# EAGLE schematic LM317 (EAGLE 7.6.0)
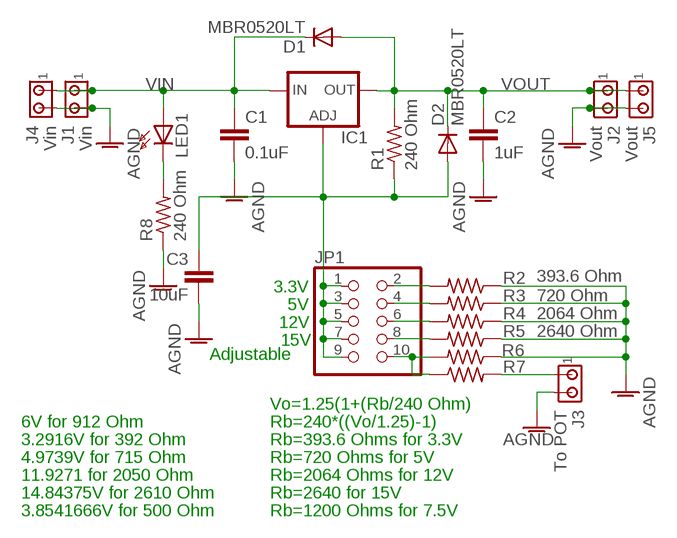
[diagram p0: schematic, sheet 1]

## Parts
C1  0.1uF  0805_PANASONIC  [0805_PANASONIC]
C2  1uF  0805_PANASONIC  [0805_PANASONIC]
C3  10uF  0805_PANASONIC  [0805_PANASONIC]
D1  MBR0520LT  [SOD123]
D2  MBR0520LT  [SOD123]
IC1  LM317TS  [317TS]
J1  Vin  AMP100640456-2  [640456-2]
J2  Vout  AMP100640456-2  [640456-2]
J3  To POT  AMP100640456-2  [640456-2]
J4  Vin  AMP100640456-2  [640456-2]
J5  Vout  AMP100640456-2  [640456-2]
JP1  PINHD-2X5  [2X05]
LED1  LED1206  [M1206]
R1  240 Ohm  R_0805_MARISS  [0805_MARISS]
R2  393.6 Ohm  R_0805_MARISS  [0805_MARISS]
R3  720 Ohm  R_0805_MARISS  [0805_MARISS]
R4  2064 Ohm  R_0805_MARISS  [0805_MARISS]
R5  2640 Ohm  R_0805_MARISS  [0805_MARISS]
R6  R_0805_MARISS  [0805_MARISS]
R7  R_0805_MARISS  [0805_MARISS]
R8  240 Ohm  R_0805_MARISS  [0805_MARISS]

## Nets
AGND: C1.2 C2.2 C3.2 J1.2 J2.2 J3.2 J4.2 J5.2 R2.1 R3.1 R4.1 R5.1 R6.1 R8.1
N$2: J3.1 R7.2
N$3: C3.1 D2.A IC1.1(ADJ) JP1.1 JP1.3 JP1.5 JP1.7 JP1.9 R1.1
N$4: JP1.10 R6.2 R7.1
N$5: JP1.8 R5.2
N$6: JP1.6 R4.2
N$7: JP1.4 R3.2
N$8: LED1.2(C) R8.2
N$9: JP1.2 R2.2
VIN: C1.1 D1.C IC1.3(IN) J1.1 J4.1 LED1.1(A)
VOUT: C2.1 D1.A D2.C IC1.2(OUT) J2.1 J5.1 R1.2

## Notes on the sheet
- 3.3V
- 5V
- 12V
- 15V
- Adjustable
- Vo=1.25(1+(Rb/240 Ohm)
- 6V for 912 Ohm | Rb=240*((Vo/1.25)-1)
- 3.2916V for 392 Ohm | Rb=393.6 Ohms for 3.3V
- 4.9739V for 715 Ohm | Rb=720 Ohms for 5V
- 11.9271 for 2050 Ohm | Rb=2064 Ohms for 12V
- 14.84375V for 2610 Ohm | Rb=2640 for 15V
- 3.8541666V for 500 Ohm | Rb=1200 Ohms for 7.5V

## Library data of the parts
C1-C3 = MyComponents:0805_PANASONIC
D1 D2 = diode:MBR0520LT: SCHOTTKY BARRIER RECTIFIER Source: http://onsemi.com .. MBR0520LT1-D.pdf
IC1 = v-reg:LM317TS: VOLTAGE REGULATOR
J1-J5 = MyAmprpt:AMP100640456-2
JP1 = Mypinhead:PINHD-2X5: PIN HEADER
LED1 = MyLED:LED
R1-R8 = MyComponents:R_0805_MARISS